# EAGLE design SparkFun_GPS_ZED-F9K (EAGLE 9.5.1)

## Sheet 1 of 7
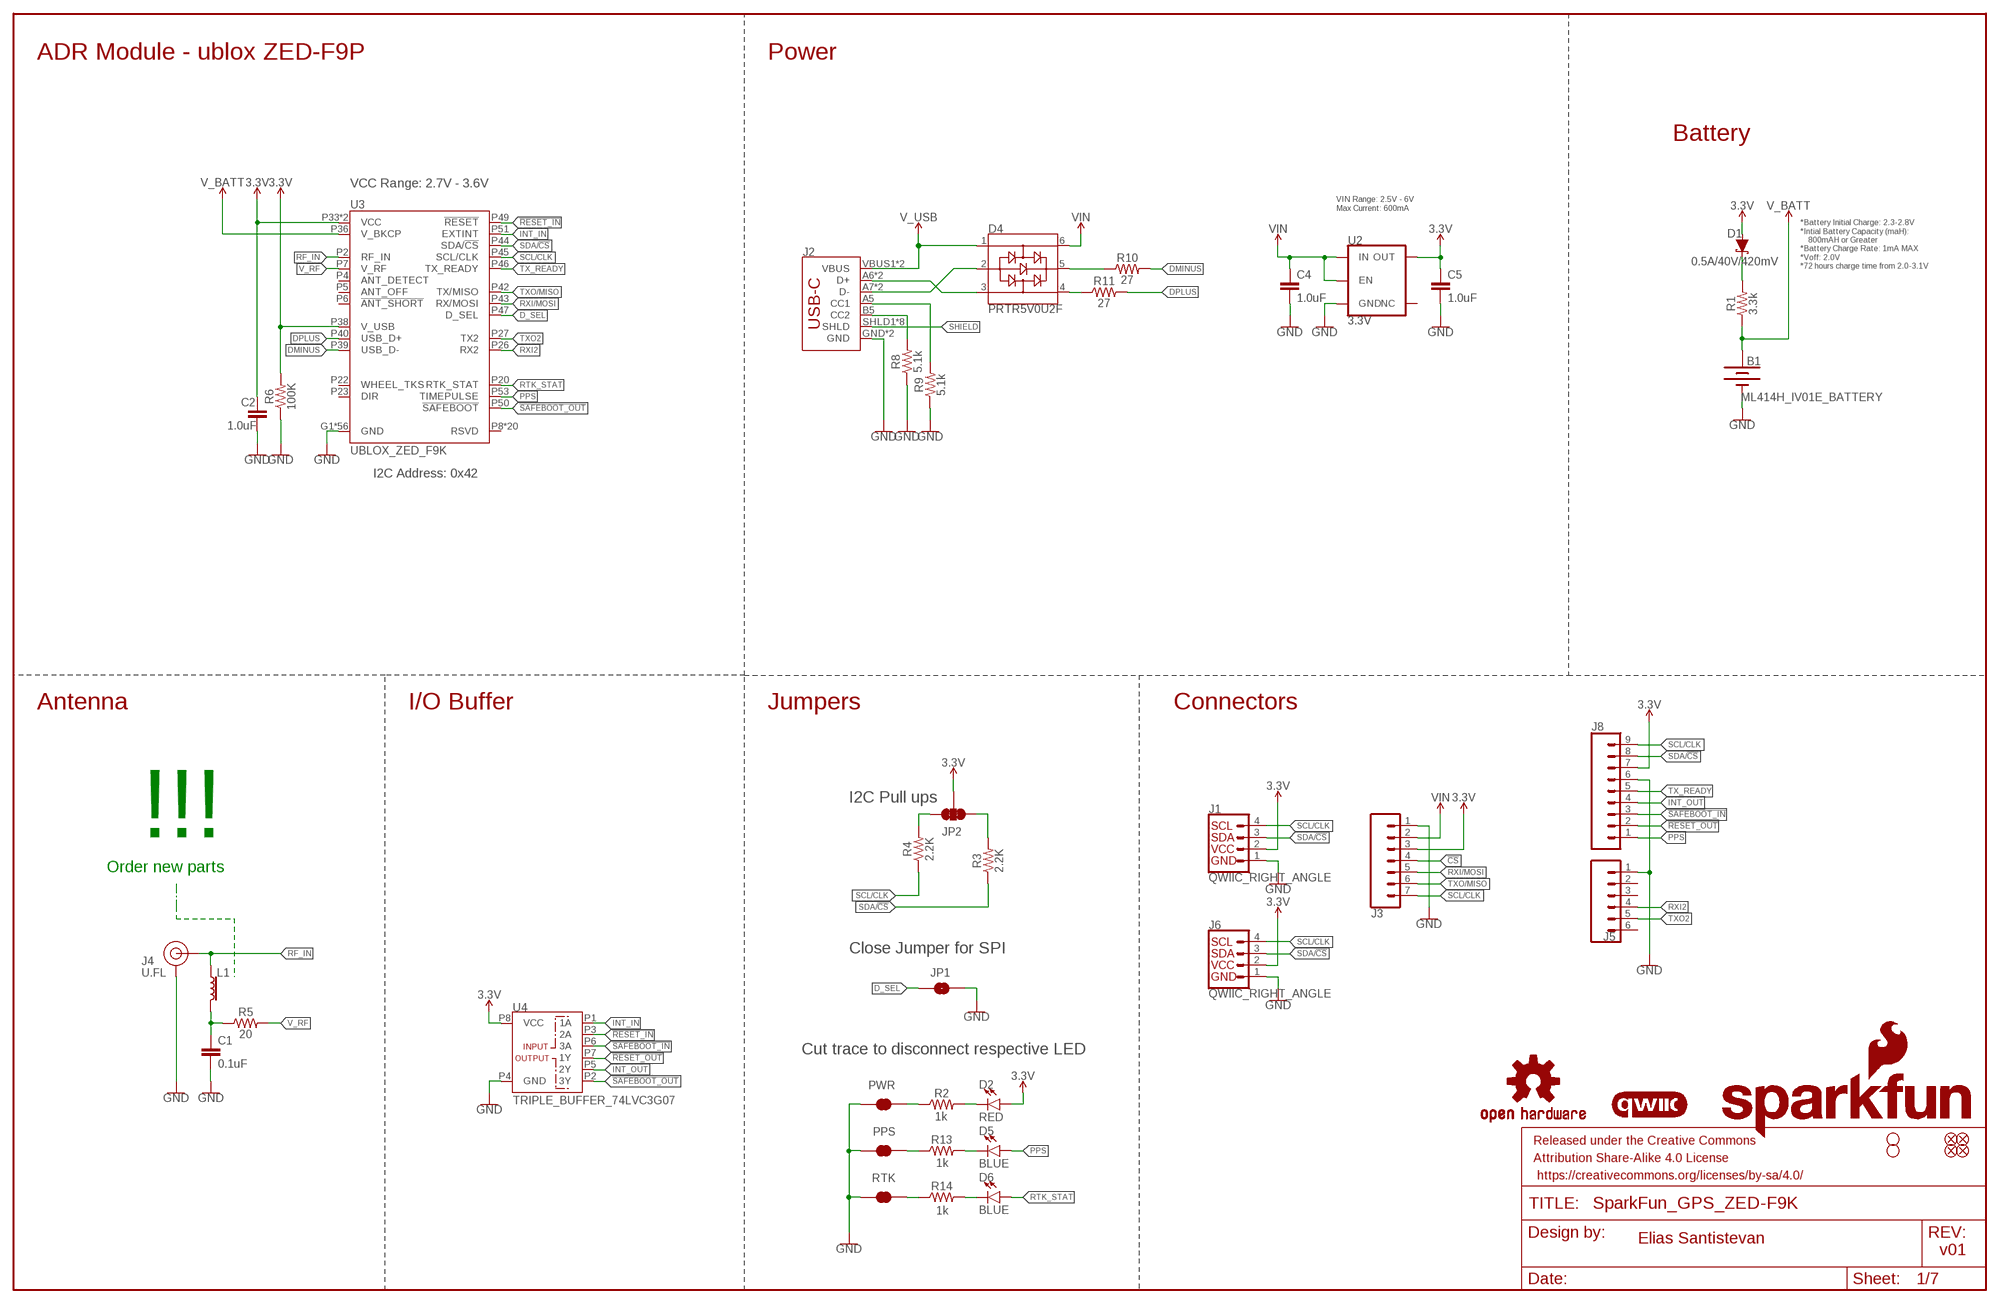
[diagram p0: schematic, sheet 1]

### Parts
B1  ML414H_IV01E_BATTERY  [ML414H_IV01E]
C1  0.1uF  0.1UF-0402-16V-10%  [0402]
C2  1.0uF  1.0UF-0402-16V-10%  [0402]
C4  1.0uF  1.0UF-0603-16V-10%-X7R  [0603]
C5  1.0uF  1.0UF-0603-16V-10%-X7R  [0603]
D1  0.5A/40V/420mV  DIODE-SCHOTTKY-PMEG4005EJ  [SOD-323]
D2  RED  LED-RED0603  [LED-0603]
D4  PRTR5V0U2F  [SOT886]
D5  BLUE  LED-BLUE0603  [LED-0603]
D6  BLUE  LED-BLUE0603  [LED-0603]
FD1  FIDUCIALUFIDUCIAL  [FIDUCIAL-MICRO]
FD2  FIDUCIALUFIDUCIAL  [FIDUCIAL-MICRO]
FD3  FIDUCIALUFIDUCIAL  [FIDUCIAL-MICRO]
FD4  FIDUCIALUFIDUCIAL  [FIDUCIAL-MICRO]
FRAME2  FRAME-LEDGER  [CREATIVE_COMMONS]
H2  STAND-OFFTIGHT  [STAND-OFF-TIGHT]
H3  STAND-OFFTIGHT  [STAND-OFF-TIGHT]
J1  QWIIC_RIGHT_ANGLE  QWIIC_CONNECTORJS-1MM  [JST04_1MM_RA]
J2  USB_C2-LAYER  [USB-C-16P]
J3  CONN_07NO_SILK  [1X07_NO_SILK]
J4  U.FL  U.FL2PIN  [U.FL]
J5  CONN_06NO_SILK_NO_POP  [1X06_NO_SILK]
J6  QWIIC_RIGHT_ANGLE  QWIIC_CONNECTORJS-1MM  [JST04_1MM_RA]
J8  CONN_09NO_SILK  [1X09_NO_SILK]
JP1  JUMPER-SMT_2_NO_SILK  [SMT-JUMPER_2_NO_SILK]
JP2  JUMPER-SMT_3_2-NC_TRACE_SILK  [SMT-JUMPER_3_2-NC_TRACE_SILK]
L1  3.9NH  FERRITE_BEAD-120_OHM-0402  [0402]
LOGO1  SFE_LOGO_NAME_FLAME.2_INCH  [SFE_LOGO_NAME_FLAME_.2]
LOGO2  QWIIC_LOGO_4MM  [QWIIC_4MM]
LOGO3  OSHW-LOGOM  [OSHW-LOGO-M]
PPS  JUMPER-SMT_2_NC_TRACE_SILK  [SMT-JUMPER_2_NC_TRACE_SILK]
PWR  JUMPER-SMT_2_NC_TRACE_SILK  [SMT-JUMPER_2_NC_TRACE_SILK]
R1  3.3k  3.3KOHM-0603-1/10W-1%  [0603]
R2  1KOHM-0402-1/16W-1%  [0402]
R3  2.2K  2.2KOHM-0402-1/16W-1%  [0402]
R4  2.2K  2.2KOHM-0402-1/16W-1%  [0402]
R5  20  20OHM-0603-1/10W-1%  [0603]
R6  100K  100KOHM-0402-1/16W-1%  [0402]
R8  5.1k  5.1KOHM-0402-1/16W-1%  [0402]
R9  5.1k  5.1KOHM-0402-1/16W-1%  [0402]
R10  27  27OHM-0603-1/10W-1%  [0603]
R11  27  27OHM-0603-1/10W-1%  [0603]
R13  1KOHM-0402-1/16W-1%  [0402]
R14  1KOHM-0402-1/16W-1%  [0402]
RTK  JUMPER-SMT_2_NC_TRACE_SILK  [SMT-JUMPER_2_NC_TRACE_SILK]
U2  3.3V  V_REG_AP2112K-3.3V  [SOT23-5]
U3  UBLOX_ZED_F9K  [UBLOX_ZED_F9K]
U4  TRIPLE_BUFFER_74LVC3G07  [SOP_8-PIN]

### Nets
3.3V: C2.1 C5.1 D1.A D2.A J1.2 J3.3 J6.2 J8.7 JP2.2 R6.2 U2.5(OUT) U3.P33(VCC) U3.P34(VCC) U3.P38(V_USB) U4.P8(VCC)
!CS: J3.4
!RESET_IN: U3.P49(!RESET!) U4.P3(2A)
!RESET_OUT: J8.2 U4.P7(1Y)
!SAFEBOOT_IN: J8.3 U4.P6(3A)
!SAFEBOOT_OUT: U3.P50(!SAFEBOOT!) U4.P2(3Y)
D_SEL: JP1.1 U3.P47(D_SEL)
DMINUS: R10.2 U3.P39(USB_D-)
DPLUS: R11.2 U3.P40(USB_D+)
GND: B1.- C1.2 C2.2 C4.2 C5.2 J1.1 J2.GND J2.GND2(GND) J3.1 J4.1(GND) J4.2(GND) J5.1 J6.1 J8.6 JP1.2 PPS.1 PWR.1 R6.1 R8.1 R9.1 RTK.1 U2.2(GND) U3.G1(GND) U3.G2(GND) U3.G3(GND) U3.G4(GND) U3.G5(GND) U3.G6(GND) U3.G7(GND) U3.G8(GND) U3.G9(GND) U3.G10(GND) U3.G11(GND) U3.G12(GND) U3.G13(GND) U3.G14(GND) U3.G15(GND) U3.G16(GND) U3.G17(GND) U3.G18(GND) U3.G19(GND) U3.G20(GND) U3.G21(GND) U3.G22(GND) U3.G23(GND) U3.G24(GND) U3.G25(GND) U3.G26(GND) U3.G27(GND) U3.G28(GND) U3.G29(GND) U3.G30(GND) U3.G31(GND) U3.G32(GND) U3.G33(GND) U3.G34(GND) U3.G35(GND) U3.G36(GND) U3.G37(GND) U3.G38(GND) U3.G39(GND) U3.G40(GND) U3.G41(GND) U3.G42(GND) U3.G43(GND) U3.G44(GND) U3.G45(GND) U3.G46(GND) U3.G47(GND) U3.G48(GND) U3.P1(GND) U3.P3(GND) U3.P12(GND) U3.P14(GND) U3.P32(GND) U3.P37(GND) U3.P41(GND) U3.P48(GND) U4.P4(GND)
INT_IN: U3.P51(EXTINT) U4.P1(1A)
INT_OUT: J8.4 U4.P5(2Y)
N$1: JP2.1 R3.2
N$2: D1.C R1.2
N$3: JP2.3 R4.2
N$4: D2.C R2.2
N$5: C1.1 L1.2 R5.1
N$6: D4.3 J2.A6(D+) J2.B6(D+)
N$7: D4.2 J2.A7(D-) J2.B7(D-)
N$8: PWR.2 R2.1
N$14: J2.B5(CC2) R8.2
N$15: J2.A5(CC1) R9.2
N$16: D4.5 R10.1
N$17: D4.4 R11.1
N$22: R14.1 RTK.2
N$23: PPS.2 R13.1
N$24: D5.C R13.2
N$25: D6.C R14.2
PPS: D5.A J8.1 U3.P53(TIMEPULSE)
RF_IN [Antenna]: J4.FEED(SIGNAL) L1.1 U3.P2(RF_IN)
RTK_STAT: D6.A U3.P20(RTK_STAT)
RXI2: J5.4 U3.P26(RX2)
RXI/MOSI: J3.5 U3.P43(RX/MOSI)
SCL/CLK: J1.4 J3.7 J6.4 J8.9 R4.1 U3.P45(SCL/CLK)
SDA/!CS: J1.3 J6.3 J8.8 R3.1 U3.P44(SDA/!CS!)
SHIELD: J2.SHLD1(SHLD) J2.SHLD2(SHLD) J2.SHLD3(SHLD) J2.SHLD4(SHLD) J2.SHLD5(SHLD) J2.SHLD6(SHLD) J2.SHLD7(SHLD) J2.SHLD8(SHLD)
TX_READY: J8.5 U3.P46(TX_READY)
TXO2: J5.5 U3.P27(TX2)
TXO/MISO: J3.6 U3.P42(TX/MISO)
V_BATT: B1.+ R1.1 U3.P36(V_BKCP)
V_RF: R5.2 U3.P7(V_RF)
V_USB: D4.1 J2.VBUS1(VBUS) J2.VBUS2(VBUS)
VIN: C4.1 D4.6 J3.2 U2.1(IN) U2.3(EN)
Unconnected: J5.2 J5.3 J5.6 U2.4(NC) U3.P4(ANT_DETECT) U3.P5(ANT_OFF) U3.P6(!ANT_SHORT!) U3.P8(RSVD) U3.P9(RSVD) U3.P10(RSVD) U3.P11(RSVD) U3.P13(RSVD) U3.P15(RSVD) U3.P16(RSVD) U3.P17(RSVD) U3.P18(RSVD) U3.P19(RSVD) U3.P21(RSVD) U3.P22(WHEEL_TKS) U3.P23(DIR) U3.P24(RSVD) U3.P25(RSVD) U3.P28(RSVD) U3.P29(RSVD) U3.P30(RSVD) U3.P31(RSVD) U3.P35(RSVD) U3.P52(RSVD) U3.P54(RSVD)

### Notes on the sheet
- ADR Module - ublox ZED-F9P | Power
- Battery
- VCC Range: 2.7V - 3.6V
- VIN Range: 2.5V - 6V
  Max Current: 600mA
- *Battery Initial Charge: 2.3-2.8V
  *Intial Battery Capacity (maH): 
      800mAH or Greater
  *Battery Charge Rate: 1mA MAX
  *Voff: 2.0V
  *72 hours charge time from 2.0-3.1V
- I2C Address: 0x42
- Antenna | I/O Buffer | Jumpers | Connectors
- I2C Pull ups
- !!!
- Order new parts
- Close Jumper for SPI
- Cut trace to disconnect respective LED
- 1k
- 1k
- 1k
- Elias Santistevan
- v01

## Sheet 2 of 7

## Sheet 3 of 7

## Sheet 4 of 7

## Sheet 5 of 7

## Sheet 6 of 7

## Sheet 7 of 7

## Library data of the parts
B1 = SparkFun-Batteries:ML414H_IV01E_BATTERY: SEIKO ML414H-IV01E Reflowable Lithium Battery ML414H is a rechargeable, coin type battery with features such as Pb-free reflowable (Peak temperature: 260 C) and high temperature heat resistance. Battery Characteristics: 3.1V max voltage Voff is 2V 1mAH 3k series resistor with battery 72 hour charge time from 2.0-3.1V 2.3-2.8V initial charge; PROD_ID: BATT-14267
C1 = SparkFun-Capacitors:0.1UF: 0.1µF ceramic capacitors A capacitor is a passive two-terminal electrical component used to store electrical energy temporarily in an electric field.; PROD_ID: CAP-12416
C2 = SparkFun-Capacitors:1.0UF: 1µF ceramic capacitors A capacitor is a passive two-terminal electrical component used to store electrical energy temporarily in an electric field.; PROD_ID: CAP-12417
C4 C5 = SparkFun-Capacitors:1.0UF: 1µF ceramic capacitors A capacitor is a passive two-terminal electrical component used to store electrical energy temporarily in an electric field.; PROD_ID: CAP-13930
D1 = SparkFun-DiscreteSemi:DIODE-SCHOTTKY: Schottky diode A Schottky diode is a semiconductor diode which has a low forward voltage drop and a very fast switching action.; PROD_ID: DIO-10955
D2 = SparkFun-LED:LED-RED: Red SMD LED Used in manufacturing of most products at SparkFun Packages: 0603 - SMD 0603 package [Product Link] <http://docs.avagotech.com/docs/AV02-0551EN> 0603 SMART - SMD 0603 SMART package ( more efficient and expensive)[Product Link] <http://www.osram-os.com/Graphics/XPic2/00077099_0.pdf> 1206 - SMD1206 package [Product Link] <https://www.sparkfun.com/datasheets/DevTools/LilyPad/Q150OVS4.pdff> SparkFun Products: Pro Mini 328 -5V <https://www.sparkfun.com/products/821> RedBoard <https://www.sparkfun.com/products/12757> IOIO-OTG <https://www.sparkfun.com/products/13613>; PROD_ID: DIO-00819
D4 = SparkFun-IC-Power:PRTR5V0U2: A small ESD protection device. Most commonly used on USB D+/D- signals to protect large, expensive, or especially sensitive USB enabled devices.; PROD_ID: DIO-14084
D5 D6 = SparkFun-LED:LED-BLUE: Blue SMD LED Used in manufacturing of various products at SparkFun Packages: 0603 - SMD 0603 package [Product Link] <http://www.digikey.com/product-detail/en/SMLE12BC7TT86/511-1589-2-ND/1641808> 1206 - SMD1206 package [Product Link] <http://www.digikey.com/product-detail/en/lite-on-inc/LTST-C150TBKT/160-1643-1-ND/573584> SparkFun Products: ESP8266 Thing-Dev Board <https://www.sparkfun.com/products/13711> RedBoard <https://www.sparkfun.com/products/12757>; PROD_ID: DIO-08575
FD1-FD4 = SparkFun-Aesthetics:FIDUCIAL: Fiducial Alignment Points Point-of-reference for pick-and-place machines and other optical instruments.
FRAME2 = SparkFun-Aesthetics:FRAME-LEDGER: Schematic Frame - Ledger Standard 11x14 US Ledger frame
H2 H3 = SparkFun-Hardware:STAND-OFF: Stand Off Drill holes for mechanically mounting via screws, standoffs, etc. Note: Use the keepout ring to avoid running the screw head into surrounding components. Variant Overviews STAND-OFF - Mechanical footprint for a #4 phillips button head screw. STAND-OFF-TIGHT - Mechanical footprint for a #4 phillips button head screw, Example SparkFun Products Screw - Phillips Head (1/4", 4-40, 10 pack) <https://www.sparkfun.com/products/10453> (PRT-10453) Screw - Phillips Head (1/2", 4-40, 10 pack) <https://www.sparkfun.com/products/10452> (PRT-10452) Screw - Phillips Head (3/4", 4-40, 10 pack) <https://www.sparkfun.com/products/10451> (PRT-10451) Screw - Phillips Head (1", 4-40, 10 pack) <https://www.sparkfun.com/products/10450> (PRT-10450)
J1 J6 = SparkFun-Connectors:QWIIC_CONNECTOR: SparkFun I2C Standard Qwiic Connector An SMD 1mm pitch JST connector makes it easy and quick (get it? Qwiic?) to connect I2C devices to each other. The Qwiic system <http://www.sparkfun.com/qwiic> enables fast and solderless connection between popular platforms and various sensors and actuators. We carry 200mm <https://www.sparkfun.com/products/14204>, 100mm <https://www.sparkfun.com/products/14205>, 50mm <https://www.sparkfun.com/products/14206>, and breadboard friendly <https://www.sparkfun.com/products/14207> Qwiic cables. We also offer 10 pcs strips <https://www.sparkfun.com/products/14323> the SMD connectors.; PROD_ID: CONN-13694
J2 = SparkFun-Connectors:USB_C: USB Type C 16Pin Connector Super Speed pins not available on the 16-pin purely SMD connector so this part is best for USB 2.0 implementations. D1 and D2 are tied together enabling D+/- no matter which way the cable is plugged into the connector. The two channel configuration pins (CC1/2) are exposed. These are normally connected to ground via 5.1k resistors but can be reconfigured for high current/high power applications.; PROD_ID: CONN-14122
J3 = SparkFun-Connectors:CONN_07: Multi connection point. Often used as Generic Header-pin footprint for 0.1 inch spaced/style header connections On any of the 0.1 inch spaced packages, you can populate with these: Break Away Headers - Straight <https://www.sparkfun.com/products/116> (PRT-00116) Break Away Male Headers - Right Angle <https://www.sparkfun.com/products/553> (PRT-00553) Female Headers <https://www.sparkfun.com/products/115> (PRT-00115) Break Away Headers - Machine Pin <https://www.sparkfun.com/products/117> (PRT-00117) Break Away Female Headers - Swiss Machine Pin <https://www.sparkfun.com/products/743> (PRT-00743) For SCREWTERMINALS and SPRING TERMINALS visit here: Screw Terimnals on SparkFun.com <https://www.sparkfun.com/search/results?term=Screw+Terminals> (5mm/3.5mm/2.54mm spacing) This device is also useful as a general connection point to wire up your design to another part of your project. Our various solder wires solder well into these plated through hole pads. Hook-Up Wire - Assortment (Stranded, 22 AWG) <https://www.sparkfun.com/products/11375> (PRT-11375) Hook-Up Wire - Assortment (Solid Core, 22 AWG) <https://www.sparkfun.com/products/11367> (PRT-11367) View the entire wire category on our website here <https://www.sparkfun.com/categories/141> Special notes: Molex polarized connector foot print use with SKU : PRT-08231 with associated crimp pins and housings. 1MM SMD Version SKU: PRT-10208 NOTES ON THE VARIANTS LOCK and LOCK_LONGPADS... This footprint was designed to help hold the alignment of a through-hole component (i.e. 6-pin header) while soldering it into place. You may notice that each hole has been shifted either up or down by 0.005 of an inch from it's more standard position (which is a perfectly straight line). This slight alteration caused the pins (the squares in the middle) to touch the edges of the holes. Because they are alternating, it causes a "brace" to hold the component in place. 0.005 has proven to be the perfect amount of "off-center" position when using our standard breakaway headers. Although looks a little odd when you look at the bare footprint, once you have a header in there, the alteration is very hard to notice. Also,if you push a header all the way into place, it is covered up entirely on the bottom side.
J4 = SparkFun-Connectors:U.FL2PIN: SMD Antenna Connector - U.FL 2mm height, 3.0mm x 3.0mm receptacle size. SparkFun Products: SparkFun WiFi Shield - ESP8266 <https://www.sparkfun.com/products/13287> SparkFun ESP8266 Thing <https://www.sparkfun.com/products/13231> SparkFun MiniGen - Pro Mini Signal Generator Shield <https://www.sparkfun.com/products/11420>; PROD_ID: CONN-09193; SF_ID: WRL-09144
J5 = SparkFun-Connectors:CONN_06: Multi connection point. Often used as Generic Header-pin footprint for 0.1 inch spaced/style header connections On any of the 0.1 inch spaced packages, you can populate with these: Break Away Headers - Straight <https://www.sparkfun.com/products/116> (PRT-00116) Break Away Male Headers - Right Angle <https://www.sparkfun.com/products/553> (PRT-00553) Female Headers <https://www.sparkfun.com/products/115> (PRT-00115) Break Away Headers - Machine Pin <https://www.sparkfun.com/products/117> (PRT-00117) Break Away Female Headers - Swiss Machine Pin <https://www.sparkfun.com/products/743> (PRT-00743) Arduino Stackable Header - 6 Pin <https://www.sparkfun.com/products/9280> (PRT-09280) For SCREWTERMINALS and SPRING TERMINALS visit here: Screw Terimnals on SparkFun.com <https://www.sparkfun.com/search/results?term=Screw+Terminals> (5mm/3.5mm/2.54mm spacing) This device is also useful as a general connection point to wire up your design to another part of your project. Our various solder wires solder well into these plated through hole pads. Hook-Up Wire - Assortment (Stranded, 22 AWG) <https://www.sparkfun.com/products/11375> (PRT-11375) Hook-Up Wire - Assortment (Solid Core, 22 AWG) <https://www.sparkfun.com/products/11367> (PRT-11367) View the entire wire category on our website here <https://www.sparkfun.com/categories/141>
J8 = SparkFun-Connectors:CONN_09: Multi connection point. Often used as Generic Header-pin footprint for 0.1 inch spaced/style header connections On any of the 0.1 inch spaced packages, you can populate with these: Break Away Headers - Straight <https://www.sparkfun.com/products/116> (PRT-00116) Break Away Male Headers - Right Angle <https://www.sparkfun.com/products/553> (PRT-00553) Female Headers <https://www.sparkfun.com/products/115> (PRT-00115) Break Away Headers - Machine Pin <https://www.sparkfun.com/products/117> (PRT-00117) Break Away Female Headers - Swiss Machine Pin <https://www.sparkfun.com/products/743> (PRT-00743) For SCREWTERMINALS and SPRING TERMINALS visit here: Screw Terimnals on SparkFun.com <https://www.sparkfun.com/search/results?term=Screw+Terminals> (5mm/3.5mm/2.54mm spacing) This device is also useful as a general connection point to wire up your design to another part of your project. Our various solder wires solder well into these plated through hole pads. Hook-Up Wire - Assortment (Stranded, 22 AWG) <https://www.sparkfun.com/products/11375> (PRT-11375) Hook-Up Wire - Assortment (Solid Core, 22 AWG) <https://www.sparkfun.com/products/11367> (PRT-11367) View the entire wire category on our website here <https://www.sparkfun.com/categories/141> Special notes: Molex polarized connector foot print use with SKU : PRT-08231 with associated crimp pins and housings. 1MM SMD Version SKU: PRT-10208 NOTES ON THE VARIANTS LOCK and LOCK_LONGPADS... This footprint was designed to help hold the alignment of a through-hole component (i.e. 6-pin header) while soldering it into place. You may notice that each hole has been shifted either up or down by 0.005 of an inch from it's more standard position (which is a perfectly straight line). This slight alteration caused the pins (the squares in the middle) to touch the edges of the holes. Because they are alternating, it causes a "brace" to hold the component in place. 0.005 has proven to be the perfect amount of "off-center" position when using our standard breakaway headers. Although looks a little odd when you look at the bare footprint, once you have a header in there, the alteration is very hard to notice. Also,if you push a header all the way into place, it is covered up entirely on the bottom side.
JP1 = SparkFun-Jumpers:JUMPER-SMT_2_NO: Normally open jumper This jumper has two pads in close proximity to each other. Apply solder to close the connection. Round pads are easier to solder for beginners, but are a lot larger. SparkFun Product that uses the round pads: SparkFun EL Sequencer <https://www.sparkfun.com/products/12781>
JP2 = SparkFun-Jumpers:JUMPER-SMT_3_2-NC_TRACE: Normally closed trace jumper (2 of 2 connections) This jumper has a trace between all three pads so they are normally closed (NC). Use a razor knife to open the connection(s). For best results follow the IPC guidelines for cutting traces: Cutout at least 0.063 mm (0.005 in). Remove all loose material to clean up the cut area. Seal the cut with an approved epoxy. Reapply solder to reclose the connection(s).
L1 = SparkFun-Coils:FERRITE_BEAD-120_OHM: Ferrite Bead (blocks, cores, rings, chokes, etc.) Inductor with layers of ferrite used to suppress high frequencies. Often used to isolate high frequency noise.; MFG_PART: BLM15HB121SN1D; PROD_ID: NDUC-14206
LOGO1 = SparkFun-Aesthetics:SFE_LOGO_NAME_FLAME: SparkFun Font Logo w/ Flame This is the SparkFun full logo. The logo on the schematic will always be the same size; the package variant is the height of the flame part of the logo. Default layer for the logo on the board is tSilk.
LOGO2 = SparkFun-Aesthetics:QWIIC_LOGO: Qwiic Logos for placement on schematic and PCB. The 5.5mm silk logo is best for placing next to Qwiic connector.
LOGO3 = SparkFun-Aesthetics:OSHW-LOGO: Open-Source Hardware (OSHW) Logo This logo indicates the piece of hardware it is found on incorporates a OSHW license and/or adheres to the definition of open source hardware found here: http://freedomdefined.org/OSHW
PPS PWR RTK = SparkFun-Jumpers:JUMPER-SMT_2_NC_TRACE: Normally closed trace jumper This jumper has a trace between two pads so it's normally closed (NC). Use a razor knife to open the connection. For best results follow the IPC guidelines for cutting traces: Cutout at least 0.063 mm (0.005 in). Remove all loose material to clean up the cut area. Seal the cut with an approved epoxy. Reapply solder to reclose the connection.
R1 = SparkFun-Resistors:3.3KOHM: 3.3kΩ resistor A resistor is a passive two-terminal electrical component that implements electrical resistance as a circuit element. Resistors act to reduce current flow, and, at the same time, act to lower voltage levels within circuits. - Wikipedia; PROD_ID: RES-07851
R2 R13 R14 = SparkFun-Resistors:1KOHM: 1kΩ resistor A resistor is a passive two-terminal electrical component that implements electrical resistance as a circuit element. Resistors act to reduce current flow, and, at the same time, act to lower voltage levels within circuits. - Wikipedia; PROD_ID: RES-14342
R3 R4 = SparkFun-Resistors:2.2KOHM: 2.2kΩ resistor A resistor is a passive two-terminal electrical component that implements electrical resistance as a circuit element. Resistors act to reduce current flow, and, at the same time, act to lower voltage levels within circuits. - Wikipedia; PROD_ID: RES-14341
R5 = SparkFun-Resistors:20OHM: RES-07862; PROD_ID: RES-07862
R6 = SparkFun-Resistors:100KOHM: 100kΩ resistor A resistor is a passive two-terminal electrical component that implements electrical resistance as a circuit element. Resistors act to reduce current flow, and, at the same time, act to lower voltage levels within circuits. - Wikipedia; PROD_ID: RES-13495
R8 R9 = SparkFun-Resistors:5.1KOHM; PROD_ID: RES-14340
R10 R11 = SparkFun-Resistors:27OHM: 27Ω resistor A resistor is a passive two-terminal electrical component that implements electrical resistance as a circuit element. Resistors act to reduce current flow, and, at the same time, act to lower voltage levels within circuits. - Wikipedia; PROD_ID: RES-09334
U2 = SparkFun-IC-Power:V_REG_AP2112: AP2112 - 600mA CMOS LDO Regulator w/ Enable The AP2112 is CMOS process low dropout linear regulator with enable function, the regulator delivers a guaranteed 600mA (min.) continuous load current. Features Output Voltage Accuracy: ±1.5% Output Current: 600mA (Min.) Foldback Short Current Protection: 50mA Enable Function to Turn ON/OFF VOUT Low Dropout Voltage (3.3V): 250mV (Typ.) @IOUT=600mA Excellent Load Regulation: 0.2%/A (Typ.) Excellent Line Regulation: 0.02%/V (Typ.) Low Quiescent Current: 55μA (Typ.) Low Standby Current: 0.01μA (Typ.) Low Output Noise: 50μVRMS PSRR: 100Hz -65dB, 1kHz -65dB OTSD Protection Stable with 1.0μF Flexible Cap: Ceramic, Tantalum and Aluminum Electrolytic Operation Temperature Range: -40°C to 85°C ESD: MM 400V, HBM 4000V; PROD_ID: VREG-12457
U3 = classified:UBLOX_ZED_F9K: u-blox ZED-F9K ADR GPS Unit with Real Time Kinematics (RTK) and internal IMU = Automotive Dead Reckoning; PROD_ID: IC-14677
U4 = classified:TRIPLE_BUFFER_74LVC3G07: Triple Buffer with Open Drain Output - 74LVC3G07 The 74LVC3G07 provides three non-inverting buffers. The output of the device is an open-drain and can be connected to other open-drain outputs to implement active-LOW wired-OR or active-HIGH wired-AND functions. Input can be driven from either 3.3 V or 5 V devices. This feature allows the use of this device in a mixed 3.3 V and 5 V environment. Schmitt trigger action at all inputs makes the circuit tolerant for slower input rise and fall time. This device is fully specified for partial power-down applications using IOFF. The IOFF circuitry disables the output, preventing the damaging backflow current through the device when it is powered down

## Net classes
1 Antenna: width 1 mm, clearance 0.3 mm

## Board
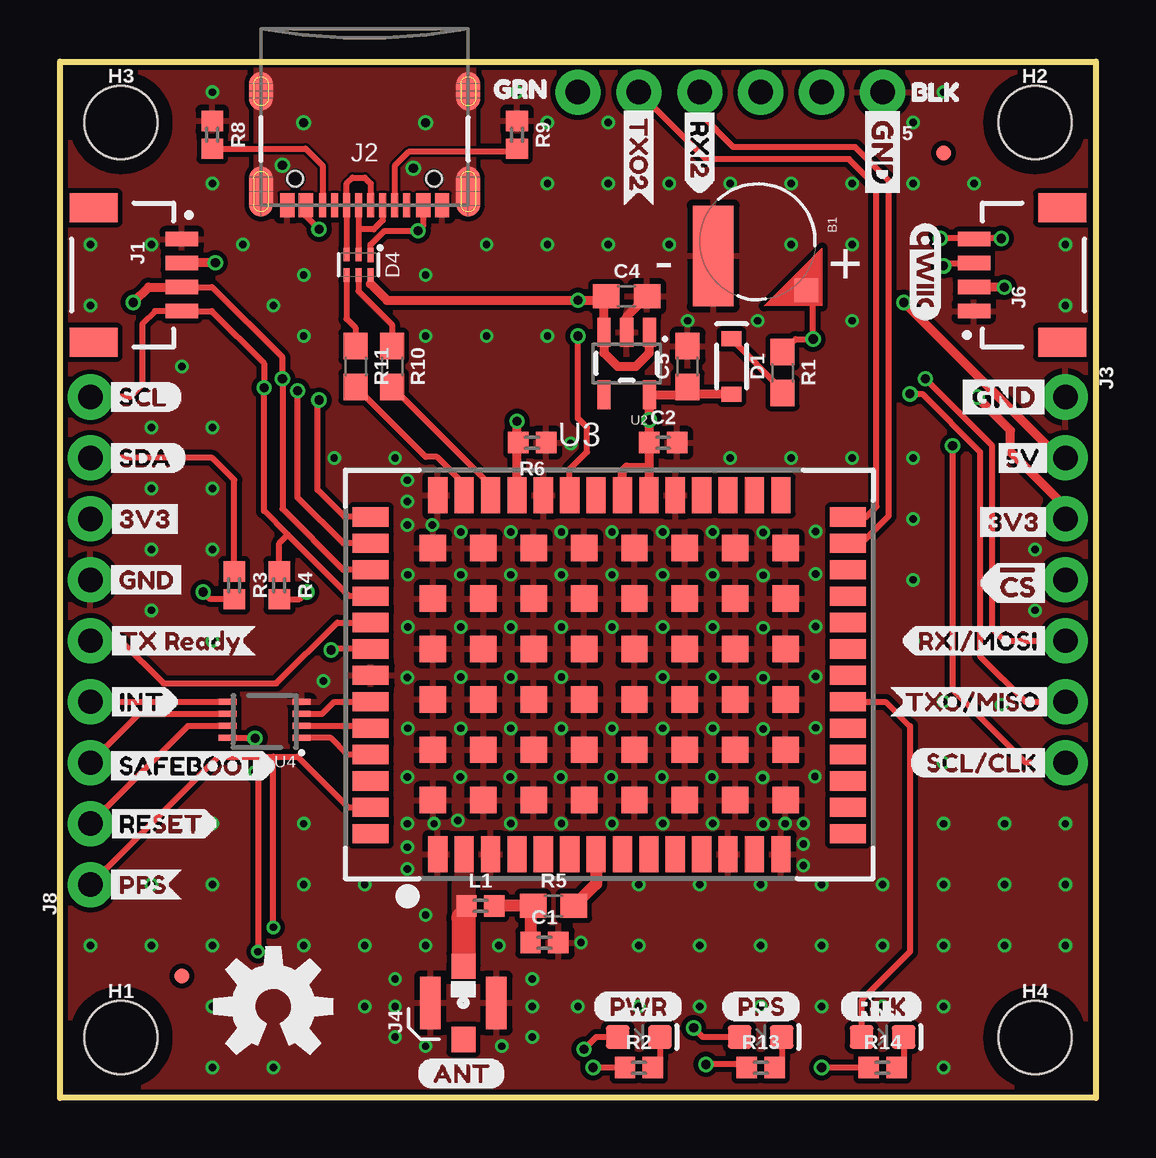
[diagram p1: board, top side]
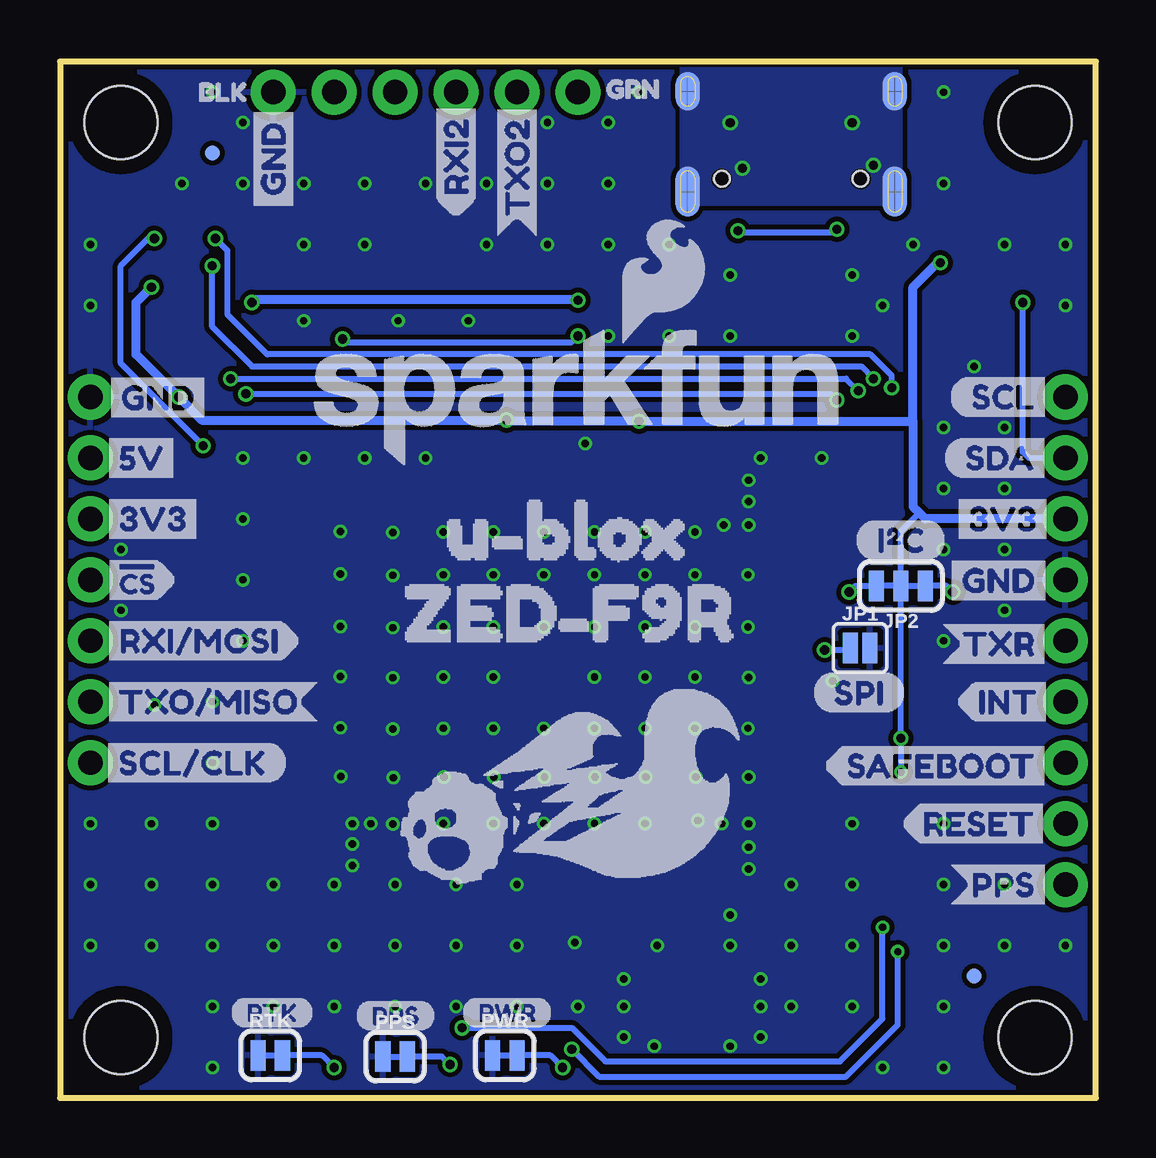
[diagram p2: board, bottom side, seen from below]

Size 43.18 x 43.18 mm. Coordinates in mm from the lower left corner, seen from the top.
Outline: 0,0 0,43.18 43.18,43.18 43.18,0 0,0
Copper layers (1*16): Top 0.035mm / dielectric 1.5mm / Bottom 0.035mm
Design rules "SparkFun-2-layer-FAB-LIMIT": minimum track width 4mil, minimum drill 6mil, track to track 4mil, track to pad 4mil, pad to pad 4mil, via to via 4mil, smd to smd 4mil, copper to edge 4mil, drill to drill 4mil, minimum pad ring 5mil, minimum via ring 5mil, stop-mask expansion 4mil, vias tented up to drill 25mil, thermal gap 10mil

### Footprints (pad centres in the part's own frame; a part is rotated, then mirrored left to right if it is on the bottom)
ML414H_IV01E = smd 1 x 1: + 2.022,2.032 | smd 4.2 x 1.7: - 0.6,-1.85
0402 = smd 0.85 x 0.9: 1 -0.58,0; 2 0.58,0
0603 = smd 1.1 x 1: 1 -0.85,0; 2 0.85,0
SOD-323 = smd 0.63 x 0.83: A 1.15,0; C -1.15,0
LED-0603 = smd 1 x 1: A -0.877,0; C 0.877,0
SOT886 = smd 0.61 x 0.25: 1 -0.405,0.5 | smd 0.56 x 0.25: 2 -0.43,0; 3 -0.43,-0.5; 4 0.43,-0.5; 5 0.43,0; 6 0.43,0.5
FIDUCIAL-MICRO = smd 0.635 x 0.635: 1 0,0
STAND-OFF-TIGHT = hole 3.048: 0,0
JST04_1MM_RA = smd 0.6 x 1.35: 1 -1.5,0; 2 -0.5,0; 3 0.5,0; 4 1.5,0 | smd 1.2 x 2: NC1 2.8,-3.675; NC2 -2.8,-3.675
USB-C-16P = smd 0.3 x 1: A5 -1.25,-0.34; A6 -0.25,-0.34; A7 0.25,-0.34; A8 1.25,-0.34; B5 1.75,-0.34; B6 0.75,-0.34; B7 -0.75,-0.34; B8 -1.75,-0.34 | smd 0.6 x 1: GND -3.225,-0.34; GND2 3.225,-0.34; VBUS1 -2.45,-0.34; VBUS2 2.45,-0.34 | smd 1 x 2.1: SHLD1 -4.32,-0.915; SHLD2 4.32,-0.915 | smd 1 x 2.1 bottom: SHLD3 -4.32,-0.915; SHLD4 4.32,-0.915 | smd 1 x 1.6: SHLD5 -4.32,-5.095; SHLD8 4.32,-5.095 | smd 1 x 1.6 bottom: SHLD6 -4.32,-5.095; SHLD7 4.32,-5.095 | hole 0.65: -2.89,-1.445; 2.89,-1.445
1X07_NO_SILK = drill 1.016 pad 1.88: 1 0,0; 2 2.54,0; 3 5.08,0; 4 7.62,0; 5 10.16,0; 6 12.7,0; 7 15.24,0
U.FL = smd 2.2 x 0.85: 1 0,1.375; 2 0,-1.375 | smd 1.05 x 1: FEED 1.525,0; NC -1.525,0
1X06_NO_SILK = drill 1.016 pad 1.88: 1 0,0; 2 2.54,0; 3 5.08,0; 4 7.62,0; 5 10.16,0; 6 12.7,0
1X09_NO_SILK = drill 1.016 pad 1.88: 1 0,0; 2 2.54,0; 3 5.08,0; 4 7.62,0; 5 10.16,0; 6 12.7,0; 7 15.24,0; 8 17.78,0; 9 20.32,0
SMT-JUMPER_2_NO_SILK = smd 0.635 x 1.27: 1 -0.406,0; 2 0.406,0
SMT-JUMPER_3_2-NC_TRACE_SILK = smd 0.635 x 1.27: 1 -1.016,0; 2 0,0; 3 1.016,0
SMT-JUMPER_2_NC_TRACE_SILK = smd 0.635 x 1.27: 1 -0.508,0; 2 0.508,0
SOT23-5 = smd 0.55 x 1.2: 1 -0.95,-1.3; 2 0,-1.3; 3 0.95,-1.3; 4 0.95,1.3; 5 -0.95,1.3
UBLOX_ZED_F9K = smd 1.1 x 1.1: G1 -7.312,-5.37; G2 -5.212,-5.37; G3 -3.112,-5.37; G4 -1.012,-5.37; G5 1.088,-5.37; G6 3.188,-5.37; G7 5.288,-5.37; G8 7.388,-5.37; G9 7.388,-3.27; G10 5.288,-3.27; G11 3.188,-3.27; G12 1.088,-3.27; G13 -1.012,-3.27; G14 -3.112,-3.27; G15 -5.212,-3.27; G16 -7.312,-3.27; G17 -7.312,-1.17; G18 -5.212,-1.17; G19 -3.112,-1.17; G20 -1.012,-1.17; G21 1.088,-1.17; G22 3.188,-1.17; G23 5.288,-1.17; G24 7.388,-1.17; G25 7.388,0.93; G26 5.288,0.93; G27 3.188,0.93; G28 1.088,0.93; G29 -1.012,0.93; G30 -3.112,0.93; G31 -5.212,0.93; G32 -7.312,0.93; G33 -7.312,3.03; G34 -5.212,3.03; G35 -3.112,3.03; G36 -1.012,3.03; G37 1.088,3.03; G38 3.188,3.03; G39 5.288,3.03; G40 7.388,3.03; G41 7.388,5.13; G42 5.288,5.13; G43 3.188,5.13; G44 1.088,5.13; G45 -1.012,5.13; G46 -3.112,5.13; G47 -5.212,5.13; G48 -7.312,5.13 | smd 0.8 x 1.5: P1 -7.112,-7.62; P2 -6.012,-7.62; P3 -4.912,-7.62; P4 -3.812,-7.62; P5 -2.712,-7.62; P6 -1.612,-7.62; P7 -0.512,-7.62; P8 0.588,-7.62; P9 1.688,-7.62; P10 2.788,-7.62; P11 3.888,-7.62; P12 4.988,-7.62; P13 6.088,-7.62; P14 7.188,-7.62; P28 7.188,7.33; P29 6.088,7.33; P30 4.988,7.33; P31 3.888,7.33; P32 2.788,7.33; P33 1.688,7.33; P34 0.588,7.33; P35 -0.512,7.33; P36 -1.612,7.33; P37 -2.712,7.33; P38 -3.812,7.33; P39 -4.912,7.33; P40 -6.012,7.33; P41 -7.112,7.33 | smd 1.5 x 0.8: P15 9.988,-6.77; P16 9.988,-5.67; P17 9.988,-4.57; P18 9.988,-3.47; P19 9.988,-2.37; P20 9.988,-1.27; P21 9.988,-0.17; P22 9.988,0.93; P23 9.988,2.03; P24 9.988,3.13; P25 9.988,4.23; P26 9.988,5.33; P27 9.988,6.43; P42 -9.912,6.43; P43 -9.912,5.33; P44 -9.912,4.23; P45 -9.912,3.13; P46 -9.912,2.03; P47 -9.912,0.93; P48 -9.912,-0.17; P49 -9.912,-1.27; P50 -9.912,-2.37; P51 -9.912,-3.47; P52 -9.912,-4.57; P53 -9.912,-5.67; P54 -9.912,-6.77
SOP_8-PIN = smd 0.75 x 0.25: P1 -1.571,0.748; P2 -1.571,0.248; P3 -1.571,-0.252; P4 -1.571,-0.752; P5 1.529,-0.752; P6 1.529,-0.252; P7 1.529,0.248; P8 1.529,0.748

### Placement (x,y rotation side)
B1  29.08,35.69 270 top
C1  20.19,6.48 0 top
C2  25.15,27.3 0 top
C4  23.62,33.4 0 top
C5  26.16,30.48 90 top
D1  27.99,30.48 270 top
D2  24.13,2.54 0 top
D4  12.45,34.72 270 top
D5  29.21,2.54 0 top
D6  34.29,2.54 0 top
FD1  36.83,39.37 0 top
FD2  5.08,5.08 0 bottom
FD3  36.83,39.37 0 bottom
FD4  5.08,5.08 0 top
FRAME2  1.78,-16.26 0 top  (outside the outline)
H1  STAND-OFFTIGHT  [STAND-OFF-TIGHT]  2.54,2.51 0 top
H2  40.64,40.64 0 top
H3  2.54,40.64 0 top
H4  STAND-OFFTIGHT  [STAND-OFF-TIGHT]  40.64,2.51 0 top
J1  5.08,34.29 270 top
J2  12.7,36.86 180 top
J3  41.91,29.21 270 top
J4  16.81,3.96 90 top
J5  34.29,41.91 180 top
J6  38.1,34.29 90 top
J8  1.27,8.89 90 top
JP1  9.83,18.75 0 bottom
JP2  8.13,21.34 180 bottom
L1  17.53,8 0 top
LOGO1  21.59,29.21 0 bottom
LOGO2  36.07,34.42 270 top
LOGO3  8.89,3.81 0 top
PPS  29.21,1.73 0 bottom
PWR  24.64,1.78 0 bottom
R1  30.12,30.23 270 top
R2  24.13,1.27 0 top
R3  7.26,21.36 270 top
R4  9.14,21.36 270 top
R5  20.57,8 0 top
R6  19.68,27.3 180 top
R8  6.35,40.13 270 top
R9  19.05,40.13 270 top
R10  13.84,30.48 270 top
R11  12.32,30.48 270 top
R13  29.21,1.27 0 top
R14  34.29,1.27 0 top
RTK  34.42,1.78 0 bottom
U2  23.62,30.61 180 top
U3  22.86,17.78 0 top
U4  8.51,15.75 180 top
U$1  [INT2]  1.78,16.51 0 top
U$2  [PPS4]  1.78,8.89 0 top
U$3  [3V32]  1.78,24.13 0 top
U$4  [PPS8]  27.56,3.81 0 top
U$5  [PWR10]  22.23,3.81 0 top
U$6  [GND3]  1.78,21.59 0 top
U$7  [RESET3]  1.78,11.43 0 top
U$8  [RTK9]  32.51,3.81 0 top
U$9  [RXI#MOSI5]  35.05,19.05 0 top
U$10  [SAFEBOOT1]  1.78,13.84 0 top
U$11  [SCL0]  1.78,29.21 0 top
U$12  [SDA1]  1.78,26.67 0 top
U$13  [SCL#CLK7]  35.43,13.97 0 top
U$14  [RXI22]  26.67,41.4 270 top
U$15  [TXO#MISO6]  34.54,16.51 0 top
U$16  [TX_READY0]  1.78,19.05 0 top
U$17  [GND-03]  37.21,29.21 0 top
U$18  [5V0]  38.73,26.67 0 top
U$19  [3V32]  37.97,24 0 top
U$20  [GND-03]  34.29,41.53 270 top
U$21  [BLK2]  34.8,41.91 0 top
U$22  [RTK9]  36.07,3.56 0 bottom
U$23  [GRN1]  17.4,42.04 0 top
U$24  [INT2]  5.84,16.51 0 bottom
U$25  [TXO21]  24.13,41.53 270 top
U$26  [CS#-<]-04]  38.1,21.46 0 top
U$27  [PPS1]  6.1,8.89 0 bottom
U$28  [RESET4]  8.13,11.43 0 bottom
U$29  [3V3-04]  41.66,24.13 0 bottom
U$30  [RXI#MOSI0]  41.66,19.05 0 bottom
U$31  [GND-04]  41.53,29.18 0 bottom
U$32  [SAFEBOOT3]  11.3,13.84 0 bottom
U$33  [5V]  41.66,26.67 0 bottom
U$34  [GND-04]  34.29,36.7 90 bottom
U$35  [RXI28]  26.67,36.7 90 bottom
U$36  [TXO21]  24.13,35.81 90 bottom
U$37  [TXO#MISO1]  41.66,16.51 0 bottom
U$38  [SCL#CLK2]  41.66,13.97 0 bottom
U$39  [SCL5]  6.1,29.21 0 bottom
U$40  [3V3-04]  6.22,24.13 0 bottom
U$41  [GND-04]  6.48,21.56 0 bottom
U$42  [SDA4]  6.35,26.67 0 bottom
U$43  [TXR3]  6.48,18.92 0 bottom
U$45  [SPI4]  11.81,16.89 0 bottom
U$46  [I_SUPER2_C-()-04]  10.03,23.24 0 bottom
U$47  [PPS8]  30.86,3.43 0 bottom
U$48  [PWR10]  26.42,3.56 0 bottom
U$49  [ANT0]  14.86,1.02 0 top
U$50  [NEO_GPS_BOARD_SILK_FINAL#03#JPG]  21.84,12.95 0 bottom
U$51  [ZED#F9R0]  30.86,20.19 0 bottom
U$52  [U#BLOX1]  29.21,23.62 0 bottom
U$53  [GRN1]  21.08,42.04 0 bottom
U$54  [BLK2]  38.1,41.91 0 bottom
U$59  [CS#-[>-04]  41.78,21.59 0 bottom

### Tracks (layer width: path | path; a pad name or v marks a point on that pad's centre or on a via)
3.3V  (via drill 0.3, 0.38)
  Top 0.254: U4.P8 8.11,15 v8.13,14.99 | D2.A 22.35,2.54 v21.84,2.03 | v8.13,13.59 8.26,13.46 v8.26,6.1
  Top 0.381: U3.P33 24.57,25.13 24.57,26.29 | U3.P34 23.45,26.11 23.62,26.29 24.57,26.29 | J6.2 v39.37,33.78 | C2.1 | 24.57,26.29 C2.1 | v6.48,34.8 J1.2 | J3.3 41.91,24.64 39.62,26.92 39.62,27.81 v38.23,29.21 | D1.A 26.46,29.33 C5.1 25.84,29.31 U2.5 v24.57,28.25 C2.1 | U3.P38 19.05,27.25 R6.2 19.05,27.36 v19.05,28.19
  Bottom 0.254: 7.37,24.38 8.13,23.62 JP2.2 v8.13,14.99 v8.13,13.59 | v21.84,2.03 20.7,0.89 10.41,0.89 8.26,3.05 v8.26,6.1
  Bottom 0.381: J8.7 7.11,24.13 7.37,24.38 7.62,24.64 7.62,28.19 | v39.37,33.78 40.01,33.15 40.01,30.99 v38.23,29.21 37.27,28.25 v24.57,28.25 24.51,28.19 v19.05,28.19 7.62,28.19 | 7.62,28.19 7.62,33.78 6.6,34.8 v6.48,34.8
!RESET_IN
  Top 0.254: U4.P3 10.92,16 11.43,16.51 U3.P49
!RESET_OUT
  Top 0.254: U4.P7 5.34,15.5 J8.2
!SAFEBOOT_IN
  Top 0.254: J8.3 3.3,16 U4.P6
!SAFEBOOT_OUT
  Top 0.254: U4.P2 12.86,15.5 U3.P50
D_SEL  (via drill 0.38)
  Top 0.254: U3.P47 11.34,18.71 v11.3,18.67
  Bottom 0.254: v11.3,18.67 10.31,18.67 JP1.1
DMINUS
  Top 0.254: U3.P39 17.95,25.52 R10.2
DPLUS
  Top 0.254: U3.P40 16.89,25.15 16.89,25.53 15.71,26.71 15.24,26.71 R11.2
GND  (via drill 0.3)
  Top 0.381: U2.2 23.62,32.55 C4.2
  other vias: 14.48,23.88 16.71,23.58 18.79,23.58 20.9,23.58 23.01,23.58 25.12,23.58 27.2,23.58 29.31,23.56 31.49,23.61 14.5,21.8 16.71,21.8 18.79,21.8 20.9,21.8 23.01,21.8 25.12,21.8 27.2,21.8 29.31,21.78 31.49,21.83 14.5,19.62 16.71,19.62 18.79,19.62 20.9,19.62 23.01,19.62 25.12,19.62 27.2,19.62 29.31,19.59 31.49,19.64 14.48,17.53 16.71,17.54 18.79,17.54 20.9,17.54 25.12,17.54 27.2,17.54 29.31,17.51 31.49,17.56 14.5,15.4 16.71,15.4 18.79,15.4 20.9,15.4 23.01,15.4 25.12,15.4 27.2,15.4 29.31,15.38 31.49,15.43 14.48,13.37 16.69,13.37 18.77,13.37 20.88,13.37 22.99,13.37 25.09,13.37 27.18,13.37 29.28,13.35 31.47,13.4 14.48,11.43 16.58,11.56 18.79,11.44 20.9,11.44 23.01,11.44 25.12,11.44 27.2,11.44 29.31,11.42 30.23,11.43 21.28,27.26 31.75,8.89 31.75,6.35 29.21,6.35 29.21,8.89 26.67,8.89 26.67,6.35 24.13,6.35 24.13,8.89 34.29,6.35 34.29,8.89 36.83,8.89 36.83,6.35 39.37,6.35 39.37,8.89 41.91,8.89 41.91,11.43 39.37,11.43 36.83,11.43 36.83,13.97 36.83,16.51 35.56,19.05 35.56,21.59 35.56,24.13 35.56,26.67 39.24,16.38 31.75,3.81 29.21,3.81 26.67,3.81 36.83,3.81 34.29,3.81 21.59,3.81 21.72,6.48 13.97,3.81 12.7,3.81 12.7,6.35 12.7,8.89 6.35,8.89 6.35,6.35 6.35,3.81 6.35,1.27 8.89,1.27 6.35,11.43 3.81,8.89 3.81,6.35 1.27,6.35 10.16,11.43 6.35,19.05 3.81,22.86 3.81,20.32 3.81,25.4 3.81,27.94 5.08,30.48 10.16,31.75 10.16,34.29 7.62,35.56 8.89,33.02 40.64,20.32 40.64,22.86 33.02,26.67 30.48,26.67 27.94,26.67 14.48,25.74 14.48,24.85 15.52,23.88 30.99,9.69 30.99,10.58 30.99,11.43 20.32,35.56 22.86,35.56 25.4,35.56 25.4,38.1 22.86,38.1 20.32,38.1 17.78,35.56 22.86,40.64 19.05,41.91 20.32,40.64 27.94,38.1 30.48,38.1 30.48,35.56 33.02,35.56 33.02,38.1 35.56,38.1 35.56,40.64 36.83,41.91 38.1,38.1 41.91,35.56 41.91,33.02 15.24,6.35 15.24,7.62 18.29,6.35 19.68,3.81 19.68,4.95 19.68,2.54 18.41,2.16 15.24,2.16 13.97,2.54 13.97,4.95 20.32,31.75 17.78,31.75 15.24,31.75 15.24,34.29 14.48,10.45 14.48,9.54 15.59,11.43 10.97,17.37 24.13,3.81 10.16,8.89 10.16,6.35 10.16,3.81 13.97,26.67 11.43,26.67 1.27,35.56 1.27,33.02 6.35,41.91 41.91,6.35 36.83,1.27 33.02,32.38 29.08,32.38 26.16,32.38 3.81,35.56 6.35,38.1 6.35,22.86 6.35,27.94 6.35,25.4
  pour Top (isolate 0.203, rank 2): 0,43.18 43.18,43.18 43.18,0 0,0
  pour Bottom (isolate 0.203, rank 2): 0,43.18 43.18,43.18 43.18,0 0,0
INT_IN
  Top 0.254: U4.P1 10.16,15 10.4,15 11.29,15 11.98,14.31 U3.P51
INT_OUT
  Top 0.254: J8.4 U4.P5
N$1  (via drill 0.38)
  Top 0.254: R3.2 6.27,20.78 v5.97,21.08
  Bottom 0.254: v5.97,21.08 6.22,21.34 JP2.1
N$2
  Top 0.254: D1.C 30.12,29.5 R1.2
N$3  (via drill 0.38)
  Top 0.254: R4.2 9.99,20.78 v10.29,21.08
  Bottom 0.254: v10.29,21.08 10.03,21.34 JP2.3
N$4
  Top 0.254: D2.C 25.01,1.57 R2.2
N$5
  Top 0.508: L1.2 R5.1 19.61,7.89 C1.1
N$6
  Top 0.254: D4.3 J2.B6 11.95,38.11 12.19,38.35 12.7,38.35 12.95,38.1 J2.A6
N$7
  Top 0.254: J2.A7 12.45,36.2 | 12.45,36.2 D4.2 | J2.B7 13.45,36.56 13.08,36.2 12.45,36.2
N$8  (via drill 0.38)
  Top 0.254: R2.1 v22.23,1.27
  Bottom 0.254: v22.23,1.27 22.73,1.78 PWR.2
N$14
  Top 0.254: J2.B5 10.95,38.83 10.23,39.55 R8.2
N$15
  Top 0.254: J2.A5 13.95,38.84 14.53,39.42 18.92,39.42 R9.2
N$16
  Top 0.254: D4.5 12.45,33.62 13.84,32.22 R10.1
N$17
  Top 0.254: D4.4 11.95,32.47 12.32,32.09 R11.1
N$22  (via drill 0.38)
  Top 0.254: R14.1 v31.75,1.27
  Bottom 0.254: v31.75,1.27 32.26,1.78 RTK.2
N$23  (via drill 0.38)
  Top 0.254: R13.1 28.5,1.4 v26.92,1.4
  Bottom 0.254: v26.92,1.4 27.25,1.73 PPS.2
N$24
  Top 0.254: D5.C 30.09,1.57 R13.2
N$25
  Top 0.254: D6.C 35.17,1.57 R14.2
PPS  (via drill 0.3, 0.38)
  Top 0.254: J8.1 6.6,14.22 8.89,14.22 | U3.P53 12.02,12.11 9.91,14.22 8.89,14.22 | D5.A 26.8,2.54 v26.42,2.92 | v8.89,7.11 8.89,14.22
  Bottom 0.254: v26.42,2.92 21.84,2.92 20.45,1.52 10.67,1.52 8.89,3.3 v8.89,7.11
RF_IN
  Top 1: 16.82,7.49 J4.FEED
  pour Top (no thermals): 16.38,10.74 16.38,7.24 17.27,7.24 17.27,10.74
RTK_STAT
  Top 0.254: U3.P20 34.42,16.51 35.43,15.49 35.43,6.1 33.41,4.08 D6.A
RXI2
  Top 0.254: U3.P26 33.4,23.11 34.54,24.26 34.54,38.23 33.15,39.62 28.07,39.62 26.67,41.02 J5.4
RXI/MOSI  (via drill 0.38)
  Top 0.254: U3.P43 11.81,23.11 9.91,25.02 v9.91,29.46 | v36.07,29.97 38.86,27.18 38.86,19.56 39.37,19.05 J3.5
  Bottom 0.254: v36.07,29.97 10.41,29.97 v9.91,29.46
SCL/CLK  (via drill 0.38)
  Top 0.254: J8.9 2.92,29.21 3.43,29.72 3.43,32.26 3.96,32.79 J1.4 6.33,32.79 8.51,30.61 v8.51,29.59 8.51,24.46 9.5,23.47 | v36.7,35.81 38.08,35.81 J6.4 38.12,35.81 v39.24,35.81 | U3.P45 12.06,20.91 9.5,23.47 | J3.7 40.26,13.97 37.21,17.02 v37.21,27.18 | R4.1 9.14,23.11 9.5,23.47
  Bottom 0.254: v8.51,29.59 8.51,30.1 9.4,30.99 34.54,30.99 36.2,32.64 36.2,35.31 v36.7,35.81 | v39.24,35.81 39.5,35.81 40.64,34.67 40.64,30.61 v37.21,27.18
SDA/!CS  (via drill 0.38)
  Top 0.254: J1.3 6.34,33.79 9.27,30.86 v9.27,29.97 9.27,24.54 11.8,22.01 U3.P44 | v36.83,34.67 36.95,34.79 J6.3 | R3.1 7.26,25.76 6.35,26.67 J8.8
  Top 0.381: v3.05,33.15 3.69,33.79 J1.3
  Bottom 0.254: J8.8 2.79,26.67 3.05,26.92 v3.05,33.15 | v9.27,29.97 9.78,30.48 35.18,30.48 36.83,32.13 v36.83,34.67
SHIELD  (via drill 0.38)
  other vias: 9.27,38.86 10.16,40.64 15.24,40.64 14.73,38.73
  pour Top (no thermals): 8.13,43.18 17.27,43.18 17.27,37.21 8.13,37.21
  pour Bottom (no thermals): 17.27,43.18 8.13,43.18 8.13,37.21 17.27,37.21
TX_READY
  Top 0.254: J8.5 2.54,19.05 4.32,17.27 9.02,17.27 11.55,19.81 U3.P46
TXO2
  Top 0.254: U3.P27 33.61,24.21 34.04,24.64 34.04,37.97 32.89,39.12 26.92,39.12 J5.5
TXO/MISO  (via drill 0.38)
  Top 0.254: U3.P42 11.86,24.21 10.73,25.34 10.73,29.02 v10.79,29.08 | v35.43,29.34 35.94,29.34 38.35,26.92 38.35,18.41 40.26,16.51 J3.6
  Bottom 0.254: v35.43,29.34 11.05,29.34 v10.79,29.08
V_BATT  (via drill 0.38)
  Top 0.254: U3.P36 21.25,26.2 21.97,26.92 21.97,27.94 21.59,28.32 v21.59,31.75 | R1.1 30.67,31.62 v31.39,31.62 31.39,33.39 B1.+
  Bottom 0.254: v31.39,31.62 31.27,31.5 21.84,31.5 v21.59,31.75
V_RF
  Top 0.508: U3.P7 22.35,8.93 R5.2
V_USB  (via drill 0.38)
  Top 0.254: J2.VBUS1 15.15,36.36 v14.92,36.13 13.53,36.13 12.95,35.55 D4.1 | J2.VBUS2 10.25,36.74 v10.79,36.2
  Bottom 0.254: v10.79,36.2 10.92,36.07 14.86,36.07 v14.92,36.13
VIN  (via drill 0.38)
  Top 0.254: D4.6 12.95,33.92
  Top 0.381: 12.95,33.92 13.63,33.23 v21.59,33.23 22.61,33.23 22.67,33.17 | U2.1 24.57,31.05 24,30.48 23.24,30.48 22.67,31.05 U2.3 22.67,33.17 | 22.67,33.17 22.67,33.3 C4.1 | J3.2 41.66,26.67 v35.18,33.15
  Bottom 0.381: v35.18,33.15 35.05,33.27 21.63,33.27 v21.59,33.23

### Text on the board
tPlace: - | +
Measures: Units In Inches
tDocu: Elias Santistevan